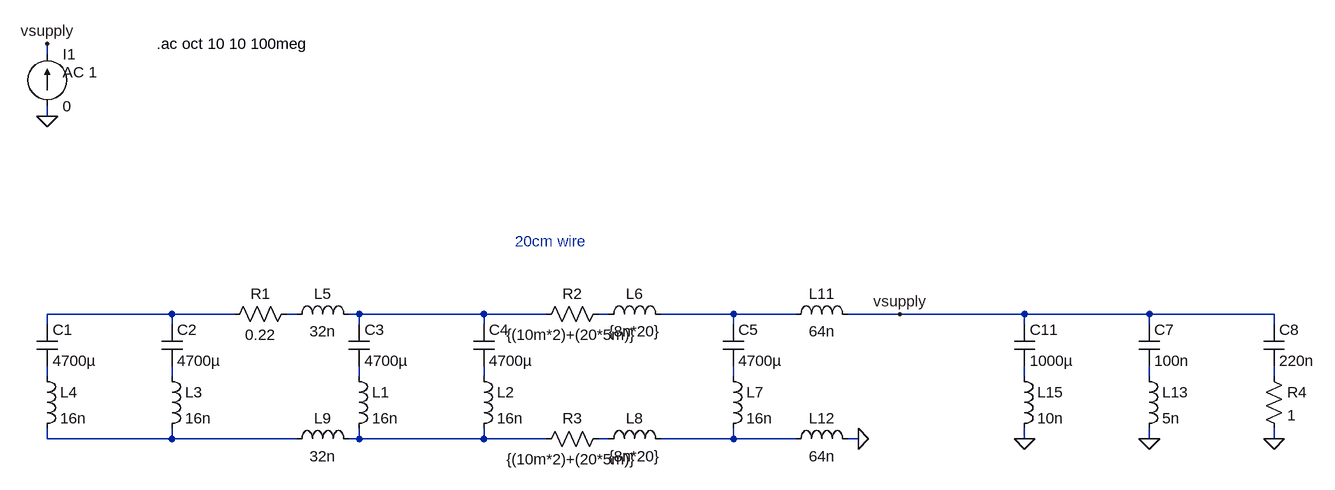
[diagram p0: schematic lm_psu.asc]
lm_psu.asc, the LTspice schematic file:
Version 4
SHEET 1 2116 680
WIRE 64 -336 64 -352
WIRE 64 -240 64 -256
WIRE 256 64 64 64
WIRE 352 64 256 64
WIRE 448 64 432 64
WIRE 544 64 528 64
WIRE 736 64 544 64
WIRE 832 64 736 64
WIRE 928 64 912 64
WIRE 1120 64 1008 64
WIRE 1216 64 1120 64
WIRE 1376 64 1296 64
WIRE 1568 64 1376 64
WIRE 1760 64 1568 64
WIRE 1952 64 1760 64
WIRE 64 80 64 64
WIRE 256 80 256 64
WIRE 544 80 544 64
WIRE 736 80 736 64
WIRE 1120 80 1120 64
WIRE 1568 80 1568 64
WIRE 1760 80 1760 64
WIRE 1952 80 1952 64
WIRE 64 160 64 144
WIRE 256 160 256 144
WIRE 544 160 544 144
WIRE 736 160 736 144
WIRE 1120 160 1120 144
WIRE 1568 160 1568 144
WIRE 1760 160 1760 144
WIRE 1952 160 1952 144
WIRE 64 256 64 240
WIRE 256 256 256 240
WIRE 256 256 64 256
WIRE 448 256 256 256
WIRE 544 256 544 240
WIRE 544 256 528 256
WIRE 736 256 736 240
WIRE 736 256 544 256
WIRE 832 256 736 256
WIRE 928 256 912 256
WIRE 1120 256 1120 240
WIRE 1120 256 1008 256
WIRE 1216 256 1120 256
WIRE 1312 256 1296 256
WIRE 1568 256 1568 240
WIRE 1760 256 1760 240
WIRE 1952 256 1952 240
FLAG 1376 64 vsupply
FLAG 64 -240 0
FLAG 64 -352 vsupply
FLAG 1312 256 0
FLAG 1760 256 0
FLAG 1952 256 0
FLAG 1568 256 0
SYMBOL cap 48 80 R0
SYMATTR InstName C1
SYMATTR Value 4700µ
SYMATTR SpiceLine V=63 Irms=3.65 Rser=55m Lser=25n Rpar=150k Cpar=1p
SYMBOL cap 240 80 R0
SYMATTR InstName C2
SYMATTR Value 4700µ
SYMATTR SpiceLine V=63 Irms=3.65 Rser=55m Lser=25n Rpar=150k Cpar=1p
SYMBOL cap 528 80 R0
SYMATTR InstName C3
SYMATTR Value 4700µ
SYMATTR SpiceLine V=63 Irms=3.65 Rser=55m Lser=25n Rpar=150k Cpar=1p
SYMBOL cap 720 80 R0
SYMATTR InstName C4
SYMATTR Value 4700µ
SYMATTR SpiceLine V=63 Irms=3.65 Rser=55m Lser=25n Rpar=150k Cpar=1p
SYMBOL res 448 48 R90
WINDOW 0 0 56 VBottom 2
WINDOW 3 32 56 VTop 2
SYMATTR InstName R1
SYMATTR Value 0.22
SYMBOL current 64 -256 M180
WINDOW 0 24 80 Left 2
WINDOW 3 24 0 Left 2
WINDOW 123 24 52 Left 2
WINDOW 39 0 0 Left 2
SYMATTR InstName I1
SYMATTR Value 0
SYMATTR Value2 AC 1
SYMBOL ind 528 144 R0
SYMATTR InstName L1
SYMATTR Value 16n
SYMATTR SpiceLine Rser=5m
SYMBOL ind 720 144 R0
SYMATTR InstName L2
SYMATTR Value 16n
SYMATTR SpiceLine Rser=5m
SYMBOL ind 240 144 R0
SYMATTR InstName L3
SYMATTR Value 16n
SYMATTR SpiceLine Rser=5m
SYMBOL ind 48 144 R0
SYMATTR InstName L4
SYMATTR Value 16n
SYMATTR SpiceLine Rser=5m
SYMBOL ind 432 80 R270
WINDOW 0 32 56 VTop 2
WINDOW 3 5 56 VBottom 2
SYMATTR InstName L5
SYMATTR Value 32n
SYMATTR SpiceLine Rser=5m
SYMBOL res 928 48 R90
WINDOW 0 0 56 VBottom 2
WINDOW 3 32 56 VTop 2
SYMATTR InstName R2
SYMATTR Value {(10m*2)+(20*5m)}
SYMBOL ind 912 80 R270
WINDOW 0 32 56 VTop 2
WINDOW 3 5 56 VBottom 2
SYMATTR InstName L6
SYMATTR Value {8n*20}
SYMATTR SpiceLine Rser=5m
SYMBOL res 928 240 R90
WINDOW 0 0 56 VBottom 2
WINDOW 3 32 56 VTop 2
SYMATTR InstName R3
SYMATTR Value {(10m*2)+(20*5m)}
SYMBOL ind 912 272 R270
WINDOW 0 32 56 VTop 2
WINDOW 3 5 56 VBottom 2
SYMATTR InstName L8
SYMATTR Value {8n*20}
SYMATTR SpiceLine Rser=5m
SYMBOL ind 432 272 R270
WINDOW 0 32 56 VTop 2
WINDOW 3 5 56 VBottom 2
SYMATTR InstName L9
SYMATTR Value 32n
SYMATTR SpiceLine Rser=5m
SYMBOL ind 1200 80 R270
WINDOW 0 32 56 VTop 2
WINDOW 3 5 56 VBottom 2
SYMATTR InstName L11
SYMATTR Value 64n
SYMATTR SpiceLine Rser=5m
SYMBOL ind 1200 272 R270
WINDOW 0 32 56 VTop 2
WINDOW 3 5 56 VBottom 2
SYMATTR InstName L12
SYMATTR Value 64n
SYMATTR SpiceLine Rser=5m
SYMBOL cap 1744 80 R0
SYMATTR InstName C7
SYMATTR Value 100n
SYMATTR SpiceLine Rser=50m Lser=7n Rpar=1meg Cpar=2p
SYMBOL ind 1744 144 R0
SYMATTR InstName L13
SYMATTR Value 5n
SYMBOL cap 1936 80 R0
SYMATTR InstName C8
SYMATTR Value 220n
SYMATTR SpiceLine Rser=150m Lser=7n
SYMBOL res 1936 144 R0
SYMATTR InstName R4
SYMATTR Value 1
SYMBOL cap 1552 80 R0
SYMATTR InstName C11
SYMATTR Value 1000µ
SYMATTR SpiceLine V=63 Irms=1.46 Rser=170m Lser=25n Rpar=485k Cpar=1p
SYMBOL ind 1552 144 R0
SYMATTR InstName L15
SYMATTR Value 10n
SYMBOL cap 1104 80 R0
SYMATTR InstName C5
SYMATTR Value 4700µ
SYMATTR SpiceLine V=63 Irms=3.65 Rser=55m Lser=25n Rpar=150k Cpar=1p
SYMBOL ind 1104 144 R0
SYMATTR InstName L7
SYMATTR Value 16n
SYMATTR SpiceLine Rser=5m
TEXT 232 -352 Left 2 !.ac oct 10 10 100meg
TEXT 784 -48 Left 2 ;20cm wire

The netlist it stands for:
* lm_psu.asc
C1 N001 N006 4700µ V=63 Irms=3.65 Rser=55m Lser=25n Rpar=150k Cpar=1p
C2 N001 N007 4700µ V=63 Irms=3.65 Rser=55m Lser=25n Rpar=150k Cpar=1p
C3 N003 N008 4700µ V=63 Irms=3.65 Rser=55m Lser=25n Rpar=150k Cpar=1p
C4 N003 N009 4700µ V=63 Irms=3.65 Rser=55m Lser=25n Rpar=150k Cpar=1p
R1 N002 N001 0.22
I1 0 vsupply 0 AC 1
L1 N008 N015 16n Rser=5m
L2 N009 N015 16n Rser=5m
L3 N007 N014 16n Rser=5m
L4 N006 N014 16n Rser=5m
L5 N002 N003 32n Rser=5m
R2 N004 N003 {(10m*2)+(20*5m)}
L6 N004 N005 {8n*20} Rser=5m
R3 N016 N015 {(10m*2)+(20*5m)}
L8 N016 N017 {8n*20} Rser=5m
L9 N014 N015 32n Rser=5m
L11 N005 vsupply 64n Rser=5m
L12 N017 0 64n Rser=5m
C7 vsupply N012 100n Rser=50m Lser=7n Rpar=1meg Cpar=2p
L13 N012 0 5n
C8 vsupply N013 220n Rser=150m Lser=7n
R4 N013 0 1
C11 vsupply N011 1000µ V=63 Irms=1.46 Rser=170m Lser=25n Rpar=485k Cpar=1p
L15 N011 0 10n
C5 N005 N010 4700µ V=63 Irms=3.65 Rser=55m Lser=25n Rpar=150k Cpar=1p
L7 N010 N017 16n Rser=5m
.ac oct 10 10 100meg
* 20cm wire
.backanno
.end